# Altium schematic sheet BMS_Slave_Rev2.SchDoc
size A
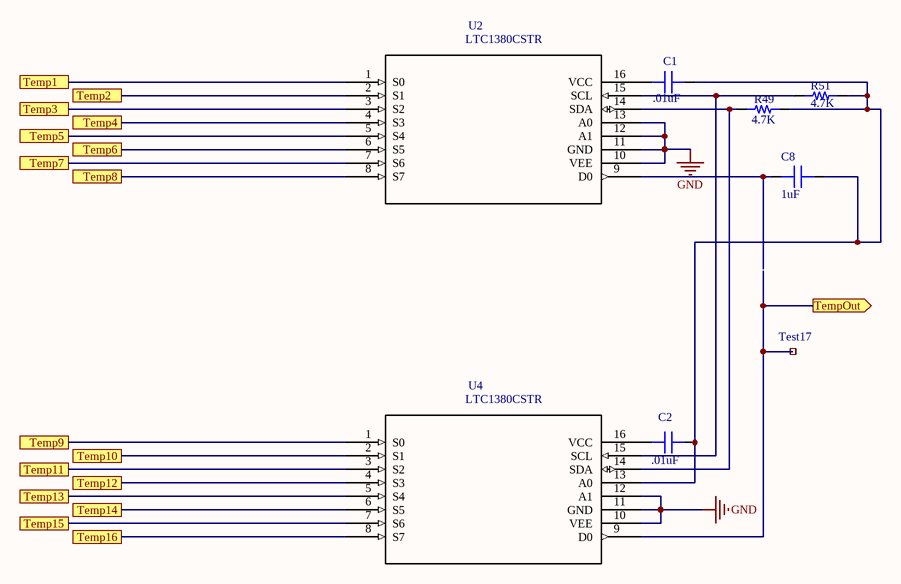
[diagram p0: BMS_Slave_Rev2.SchDoc]

## Parts
C1  capacitance: .01uF  [0603]  (hidden comment: capacitor)
C2  capacitance: .01uF  [0603]  (hidden comment: capacitor)
C8  capacitance: 1uF  [0603]  (hidden comment: capacitor)
R49  resistance: 4.7K  [0603]  (hidden comment: resistor)
R51  resistance: 4.7K  [0603]  (hidden comment: resistor)
Test17  RCU-0C  [RCU-0C]  (value not drawn)
U2  LTC1380CSTR  [SO-16_S]
U4  LTC1380CSTR  [SO-16_S]

## Ports
Temp1, Temp2, Temp3, Temp4, Temp5, Temp6, Temp7, Temp8, Temp9, Temp10, Temp11, Temp12, Temp13, Temp14, Temp15, Temp16, TempOut (out)

## Nets
GND: U2.10(VEE) U2.11(GND) U2.12(A1) U2.13(A0) U4.10(VEE) U4.11(GND) U4.12(A1)
Temp1: U2.1(S0) ; port Temp1
Temp2: U2.2(S1) ; port Temp2
Temp3: U2.3(S2) ; port Temp3
Temp4: U2.4(S3) ; port Temp4
Temp5: U2.5(S4) ; port Temp5
Temp6: U2.6(S5) ; port Temp6
Temp7: U2.7(S6) ; port Temp7
Temp8: U2.8(S7) ; port Temp8
Temp9: U4.1(S0) ; port Temp9
Temp10: U4.2(S1) ; port Temp10
Temp11: U4.3(S2) ; port Temp11
Temp12: U4.4(S3) ; port Temp12
Temp13: U4.5(S4) ; port Temp13
Temp14: U4.6(S5) ; port Temp14
Temp15: U4.7(S6) ; port Temp15
Temp16: U4.8(S7) ; port Temp16
TempOut: Test17.1 U4.9(D0) ; port TempOut
NetC1_1: C1.1 U2.16(VCC)
NetC1_2: C1.2 C2.2 C8.2 R49.2 R51.2 U4.13(A0)
NetC2_1: C2.1 U4.16(VCC)
NetC8_1: C8.1 U2.9(D0)
NetR49_1: R49.1 U2.14(SDA) U4.14(SDA)
NetR51_1: R51.1 U2.15(SCL) U4.15(SCL)

## Library data of the parts
C1 C2 C8 = 1: Generic 0603 capacitor; id: 1; voltage: 50; dielectric: Ceramic; percent tolerance: 10; name: 0603 Capacitor; ESR: 1; package: 0603; quantity: 0
R49 R51 = 1: id: 1; name: 0603 Resistor; percent tolerance: 5; package: 0603; quantity: 0
Test17 = 14: id: 14; numcontacts: 1; name: RCU-0C; numrows: 1; quantity: 0; link: https://www.digikey.com/product-detail/en/te-connectivity-amp-connectors/RCU-0C/A106145CT-ND/3477802
U2 U4 = LTC1380CSTR: LTC1380 - Single-Ended 8-Channel/ Differential 4-Channel Analog Multiplexer with SMBus Interface; MF: Linear Technology; MP: LTC1380CS#TR; Package: SO-16 Linear Technology; Price: None; Availability: Unavailable; SnapEDA_Link: https://www.snapeda.com/parts/LTC1380CS%23TR/Linear%20Technology/view-part/?ref=snap; Value: *